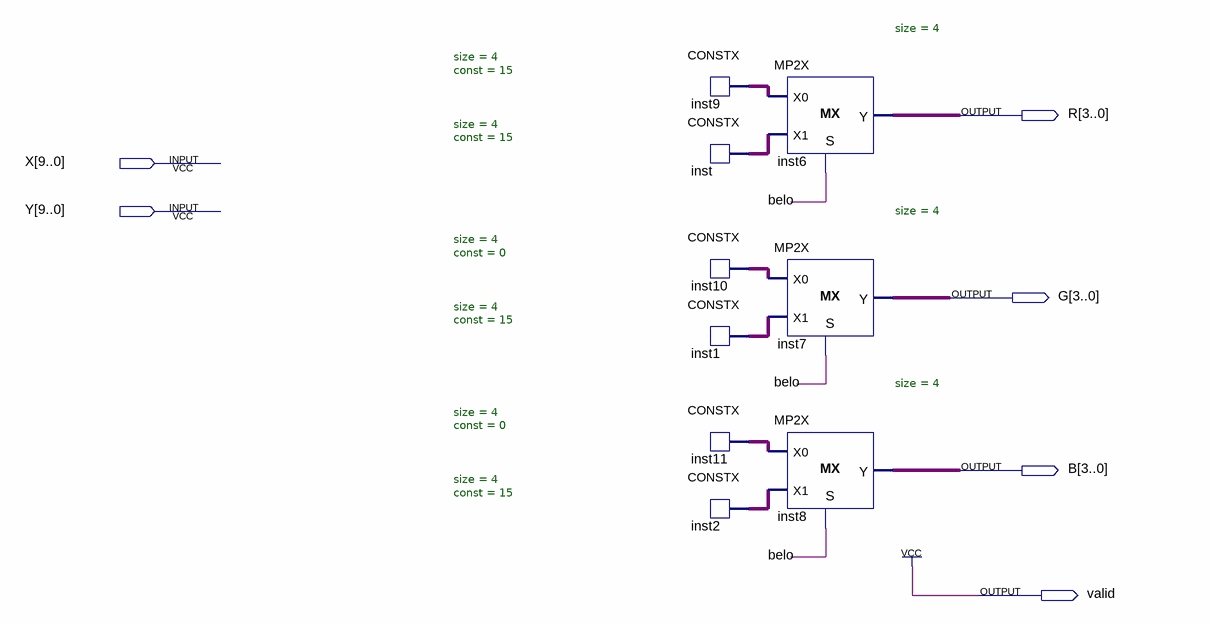
[diagram p0: schematic sheet]
// Quartus schematic Layer0.bdf as structural Verilog: 9 symbols, 6 pins
module Layer0 (
  input  [9:0] X,
  input  [9:0] Y,
  output [3:0] R,
  output [3:0] G,
  output [3:0] B,
  output valid
);

  wire belo;
  wire [3:0] inst1_data, inst2_data, inst9_data, inst10_data, inst11_data, inst_data;

  CONSTX #(.size(4), .\const (15)) inst9 (.data(inst9_data));
  CONSTX #(.size(4), .\const (15)) inst (.data(inst_data));
  CONSTX #(.size(4), .\const (0)) inst10 (.data(inst10_data));
  CONSTX #(.size(4), .\const (15)) inst1 (.data(inst1_data));
  CONSTX #(.size(4), .\const (0)) inst11 (.data(inst11_data));
  CONSTX #(.size(4), .\const (15)) inst2 (.data(inst2_data));
  MP2X #(.size(4)) inst6 (.S(belo), .X0(inst9_data), .X1(inst_data), .Y(R));
  MP2X #(.size(4)) inst7 (.S(belo), .X0(inst10_data), .X1(inst1_data), .Y(G));
  MP2X #(.size(4)) inst8 (.S(belo), .X0(inst11_data), .X1(inst2_data), .Y(B));

  assign valid = 1'b1;
endmodule
